# EAGLE schematic Drum Controller (EAGLE 9.2.2)
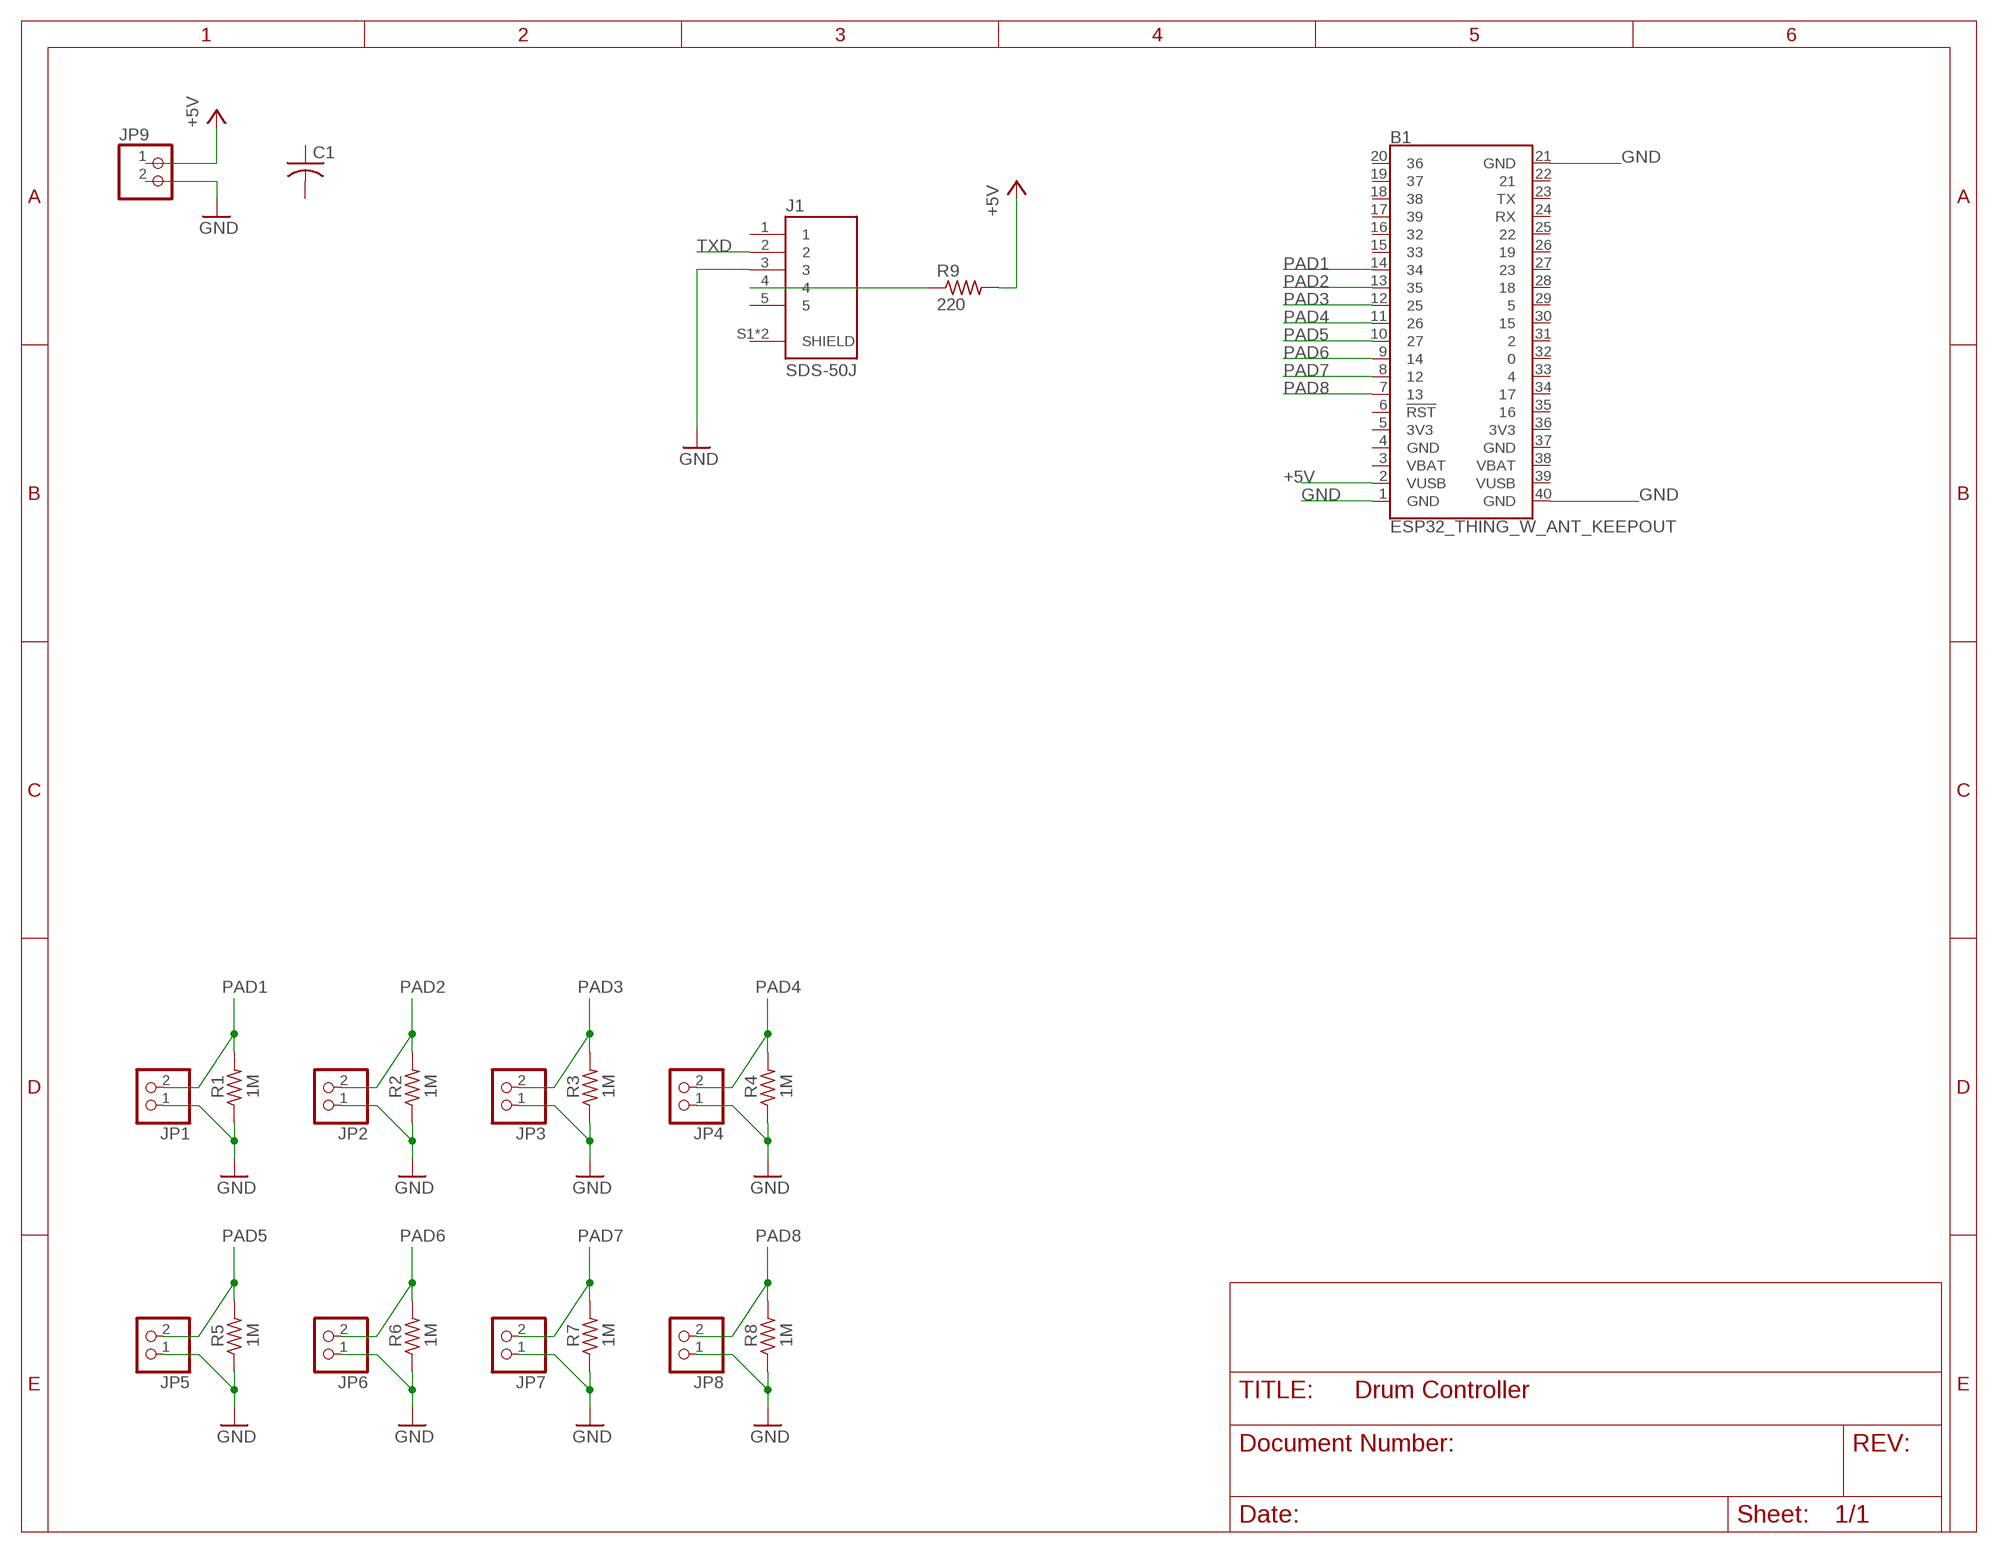
[diagram p0: schematic, sheet 1]

## Parts
B1  ESP32_THING_W_ANT_KEEPOUT  [ESP32_THING]
C1  C-US050-025X075  [C050-025X075]
J1  SDS-50J  [CUI_SDS-50J]
JP1  PINHD-1X2  [1X02]
JP2  PINHD-1X2  [1X02]
JP3  PINHD-1X2  [1X02]
JP4  PINHD-1X2  [1X02]
JP5  PINHD-1X2  [1X02]
JP6  PINHD-1X2  [1X02]
JP7  PINHD-1X2  [1X02]
JP8  PINHD-1X2  [1X02]
JP9  PINHD-1X2  [1X02]
R1  1M  R-US_V526-0  [V526-0]
R2  1M  R-US_V526-0  [V526-0]
R3  1M  R-US_V526-0  [V526-0]
R4  1M  R-US_V526-0  [V526-0]
R5  1M  R-US_V526-0  [V526-0]
R6  1M  R-US_V526-0  [V526-0]
R7  1M  R-US_V526-0  [V526-0]
R8  1M  R-US_V526-0  [V526-0]
R9  220  R-US_V526-0  [V526-0]

## Nets
+5V: B1.2(VUSB) JP9.1 R9.2
GND: B1.1(GND) B1.21(GND) B1.40(GND) J1.3 JP1.1 JP2.1 JP3.1 JP4.1 JP5.1 JP6.1 JP7.1 JP8.1 JP9.2 R1.1 R2.1 R3.1 R4.1 R5.1 R6.1 R7.1 R8.1
N$1: J1.4 R9.1
PAD1: B1.14 JP1.2 R1.2
PAD2: B1.13 JP2.2 R2.2
PAD3: B1.12 JP3.2 R3.2
PAD4: B1.11 JP4.2 R4.2
PAD5: B1.10 JP5.2 R5.2
PAD6: B1.9 JP6.2 R6.2
PAD7: B1.8 JP7.2 R7.2
PAD8: B1.7 JP8.2 R8.2
TXD: J1.2
Unconnected: B1.3(VBAT) B1.4(GND) B1.5(3V3) B1.6(!RST!) B1.15 B1.16 B1.17 B1.18 B1.19 B1.20 B1.22 B1.23(TX) B1.24(RX) B1.25 B1.26 B1.27 B1.28 B1.29 B1.30 B1.31 B1.32 B1.33 B1.34 B1.35 B1.36(3V3) B1.37(GND) B1.38(VBAT) B1.39(VUSB) C1.1 C1.2 J1.1 J1.5 J1.S1(SHIELD) J1.S2(SHIELD)

## Library data of the parts
B1 = SparkFun-Boards:ESP32_THING: SparkFun ESP32 Thing Board Pins, silkscreen, and logos matching the layout of the SparkFun ESP32 Thing <https://www.sparkfun.com/products/13907> Dimensions: 2.32" x 1.00"; SF_ID: DEV-13907
C1 = rcl:C-US: CAPACITOR, American symbol
J1 = VanEagleLib:SDS-50J: Standard Din Connector 5 Pin, Right-Angle Receptacle, 180°; MF: CUI Inc; STANDARD: Manufacturer recommendations
JP1-JP9 = pinhead:PINHD-1X2: PIN HEADER
R1-R9 = rcl:R-US_: RESISTOR, American symbol